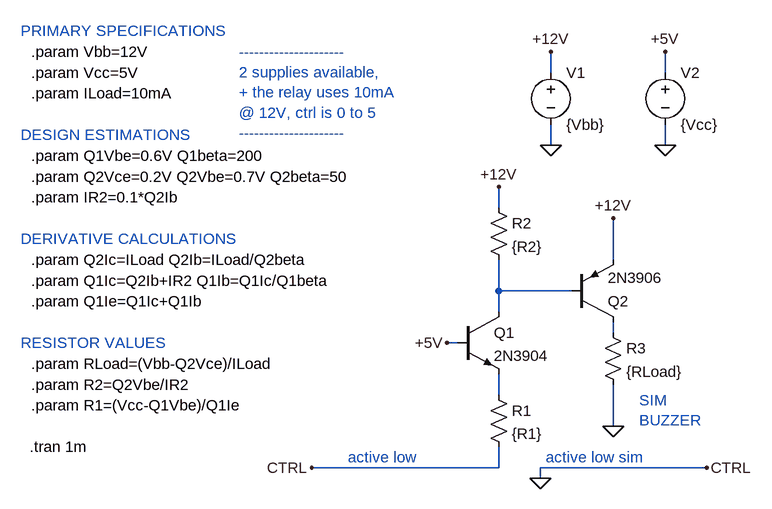
[diagram p0: schematic buzzer.asc]
buzzer.asc, the LTspice schematic file:
Version 4
SHEET 1 880 680
WIRE -224 -32 -240 -32
WIRE -160 -240 -160 -272
WIRE -160 -112 -160 -160
WIRE -160 -80 -160 -112
WIRE -160 48 -160 16
WIRE -160 160 -448 160
WIRE -160 160 -160 128
WIRE -96 176 -96 160
WIRE -80 -448 -80 -480
WIRE -80 -336 -80 -368
WIRE -48 -112 -160 -112
WIRE 16 -160 16 -224
WIRE 16 -48 16 -64
WIRE 16 96 16 32
WIRE 96 -448 96 -480
WIRE 96 -336 96 -368
WIRE 160 160 -96 160
FLAG 16 -224 +12V
FLAG -160 -272 +12V
FLAG -80 -336 0
FLAG -80 -480 +12V
FLAG 96 -336 0
FLAG 16 96 0
FLAG 96 -480 +5V
FLAG -448 160 CTRL
FLAG 160 160 CTRL
FLAG -96 176 0
FLAG -240 -32 +5V
SYMBOL pnp -48 -64 M180
SYMATTR InstName Q2
SYMATTR Value 2N3906
SYMBOL res -176 -256 R0
SYMATTR InstName R2
SYMATTR Value {R2}
SYMBOL npn -224 -80 R0
SYMATTR InstName Q1
SYMATTR Value 2N3904
SYMBOL res -176 32 R0
SYMATTR InstName R1
SYMATTR Value {R1}
SYMBOL voltage -80 -464 R0
WINDOW 123 0 0 Left 0
WINDOW 39 0 0 Left 0
SYMATTR InstName V1
SYMATTR Value {Vbb}
SYMBOL voltage 96 -464 R0
WINDOW 123 0 0 Left 0
WINDOW 39 0 0 Left 0
SYMATTR InstName V2
SYMATTR Value {Vcc}
SYMBOL res 0 -64 R0
SYMATTR InstName R3
SYMATTR Value {RLoad}
TEXT -882 128 Left 0 !.tran 1m
TEXT -880 -416 Left 0 !.param ILoad=10mA
TEXT -880 -480 Left 0 !.param Vbb=12V
TEXT -880 -448 Left 0 !.param Vcc=5V
TEXT 56 56 Left 0 ;SIM\nBUZZER
TEXT -896 -512 Left 0 ;PRIMARY SPECIFICATIONS
TEXT -896 -352 Left 0 ;DESIGN ESTIMATIONS
TEXT -880 -288 Left 0 !.param Q2Vce=0.2V Q2Vbe=0.7V Q2beta=50
TEXT -880 -320 Left 0 !.param Q1Vbe=0.6V Q1beta=200
TEXT -896 -192 Left 0 ;DERIVATIVE CALCULATIONS
TEXT -880 0 Left 0 !.param RLoad=(Vbb-Q2Vce)/ILoad
TEXT -880 -160 Left 0 !.param Q2Ic=ILoad Q2Ib=ILoad/Q2beta
TEXT -880 -256 Left 0 !.param IR2=0.1*Q2Ib
TEXT -880 -128 Left 0 !.param Q1Ic=Q2Ib+IR2 Q1Ib=Q1Ic/Q1beta
TEXT -880 -96 Left 0 !.param Q1Ie=Q1Ic+Q1Ib
TEXT -896 -32 Left 0 ;RESISTOR VALUES
TEXT -880 32 Left 0 !.param R2=Q2Vbe/IR2
TEXT -880 64 Left 0 !.param R1=(Vcc-Q1Vbe)/Q1Ie
TEXT -392 144 Left 0 ;active low
TEXT -88 144 Left 0 ;active low sim
TEXT -560 -480 Left 0 ;---------------------\n2 supplies available,\n+ the relay uses 10mA\n@ 12V, ctrl is 0 to 5\n---------------------

The netlist it stands for:
* buzzer.asc
Q2 N003 N001 +12V 0 2N3906
R2 +12V N001 {R2}
Q1 N001 +5V N002 0 2N3904
R1 N002 0 {R1}
V1 +12V 0 {Vbb}
V2 +5V 0 {Vcc}
R3 N003 0 {RLoad}
.model NPN NPN
.model PNP PNP
.lib standard.bjt
.tran 1m
.param ILoad=10mA
.param Vbb=12V
.param Vcc=5V
* SIM
* BUZZER
* PRIMARY SPECIFICATIONS
* DESIGN ESTIMATIONS
.param Q2Vce=0.2V Q2Vbe=0.7V Q2beta=50
.param Q1Vbe=0.6V Q1beta=200
* DERIVATIVE CALCULATIONS
.param RLoad=(Vbb-Q2Vce)/ILoad
.param Q2Ic=ILoad Q2Ib=ILoad/Q2beta
.param IR2=0.1*Q2Ib
.param Q1Ic=Q2Ib+IR2 Q1Ib=Q1Ic/Q1beta
.param Q1Ie=Q1Ic+Q1Ib
* RESISTOR VALUES
.param R2=Q2Vbe/IR2
.param R1=(Vcc-Q1Vbe)/Q1Ie
* active low
* active low sim
* ---------------------
* 2 supplies available,
* + the relay uses 10mA
* @ 12V, ctrl is 0 to 5
* ---------------------
.backanno
.end